# Altium schematic sheet Sheet3.SchDoc
size A4; SheetNumber: 3; SheetTotal: 3
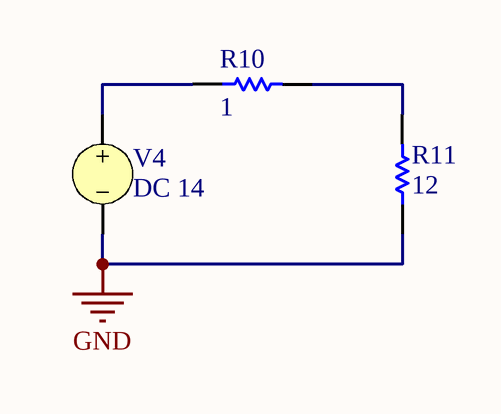
[diagram p0: Sheet3.SchDoc]

## Parts
R10  value 1  (hidden comment: Resistor)
R11  value 12  (hidden comment: Resistor)
V4  DC 14

## Nets
GND: R11.1 V4.2
NetR10_1: R10.1 V4.1
NetR10_2: R10.2 R11.2

## Library data of the parts
R10 R11 = Resistor: TC1: 0; SimulationGenericComponent: True; TC2: 0
V4 = VSRC: Voltage Source; Note: PCB Footprint - Not required; AC Magnitude: 1; AC Phase: 0; Value: 14; Published: 8-Jun-2000; LatestRevisionDate: 17-Jul-2002; LatestRevisionNote: Re-released for DXP Platform.; PackageReference: Not Applicable; Publisher: Altium Limited